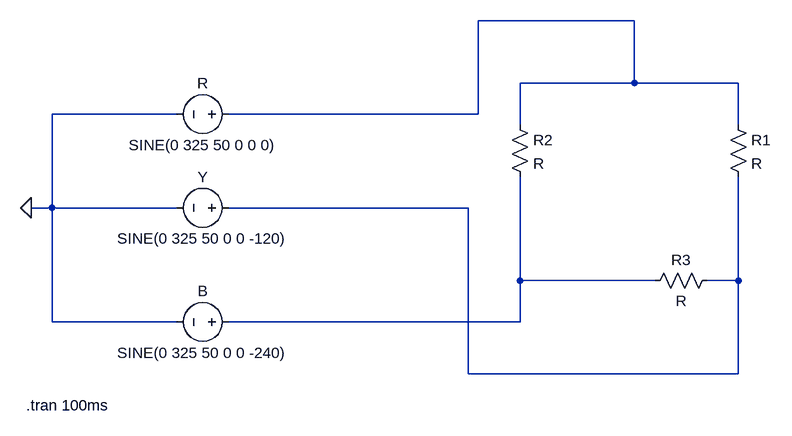
[diagram p0: schematic 3phase 2.asc]
3phase 2.asc, the LTspice schematic file:
Version 4
SHEET 1 880 680
WIRE 496 -32 256 -32
WIRE 496 64 496 -32
WIRE 496 64 320 64
WIRE 656 64 496 64
WIRE -208 112 -400 112
WIRE 256 112 256 -32
WIRE 256 112 -128 112
WIRE 320 128 320 64
WIRE 656 128 656 64
WIRE -400 256 -400 112
WIRE -400 256 -432 256
WIRE -208 256 -400 256
WIRE 240 256 -128 256
WIRE 320 368 320 208
WIRE 528 368 320 368
WIRE 656 368 656 208
WIRE 656 368 608 368
WIRE -400 432 -400 256
WIRE -208 432 -400 432
WIRE 320 432 320 368
WIRE 320 432 -128 432
WIRE 240 512 240 256
WIRE 656 512 656 368
WIRE 656 512 240 512
FLAG -432 256 0
SYMBOL voltage -112 112 R90
WINDOW 0 -32 56 VBottom 2
WINDOW 3 32 56 VTop 2
WINDOW 123 0 0 Left 0
WINDOW 39 0 0 Left 0
SYMATTR InstName R
SYMATTR Value SINE(0 325 50 0 0 0)
SYMBOL voltage -112 256 R90
WINDOW 0 -32 56 VBottom 2
WINDOW 3 32 56 VTop 2
WINDOW 123 0 0 Left 0
WINDOW 39 0 0 Left 0
SYMATTR InstName Y
SYMATTR Value SINE(0 325 50 0 0 -120)
SYMBOL voltage -112 432 R90
WINDOW 0 -32 56 VBottom 2
WINDOW 3 32 56 VTop 2
WINDOW 123 0 0 Left 0
WINDOW 39 0 0 Left 0
SYMATTR InstName B
SYMATTR Value SINE(0 325 50 0 0 -240)
SYMBOL res 640 112 R0
SYMATTR InstName R1
SYMBOL res 304 112 R0
SYMATTR InstName R2
SYMBOL res 624 352 R90
WINDOW 0 0 56 VBottom 2
WINDOW 3 32 56 VTop 2
SYMATTR InstName R3
TEXT -440 560 Left 2 !.tran 100ms

The netlist it stands for:
* 3phase 2.asc
V§R N001 0 SINE(0 325 50 0 0 0)
V§Y N002 0 SINE(0 325 50 0 0 -120)
V§B N003 0 SINE(0 325 50 0 0 -240)
R1 N001 N002 R
R2 N001 N003 R
R3 N002 N003 R
.tran 100ms
.backanno
.end